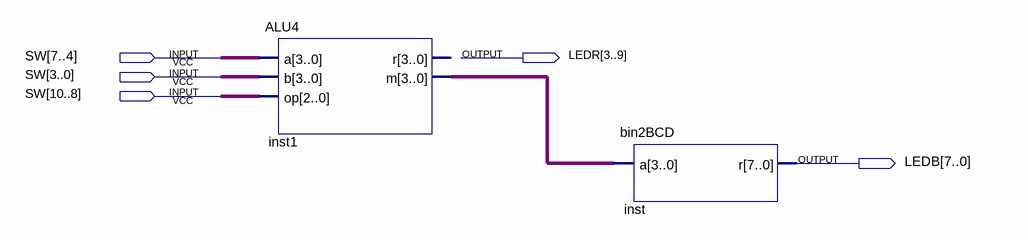
[diagram p0: schematic sheet]
// Quartus schematic ALU_BCD.bdf as structural Verilog: 2 symbols, 5 pins
module ALU_BCD (
  input  [10:0] SW,
  output [3:9] LEDR,
  output [7:0] LEDB
);

  wire [3:0] inst1_m;

  ALU4 inst1 (.a(SW[7:4]), .b(SW[3:0]), .op(SW[10:8]), .m(inst1_m));  // open: r
  bin2BCD inst (.a(inst1_m), .r(LEDB));
endmodule
